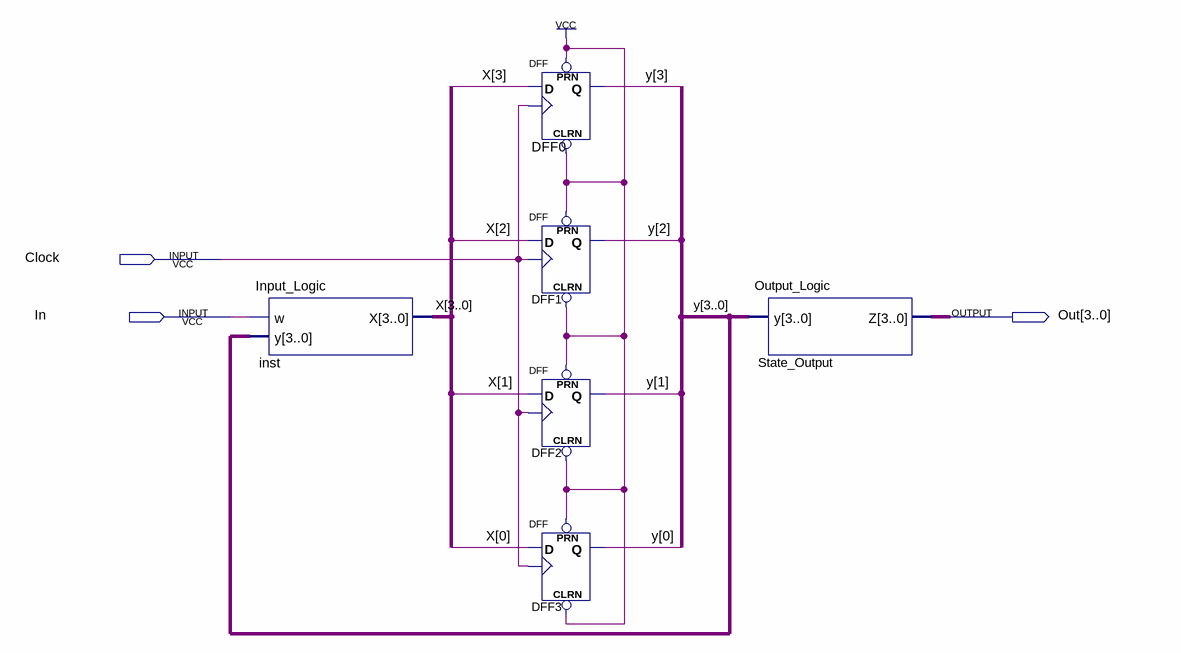
[diagram p0: schematic sheet]
// Quartus schematic TLC_Mk1.bdf as structural Verilog: 6 symbols, 3 pins
module TLC_Mk1 (
  input  Clock,
  input  In,
  output [3:0] Out
);

  wire [3:0] X, y;

  Input_Logic inst (.w(In), .y(y), .X(X));
  DFF DFF0 (.CLRN(1'b1), .CLK(Clock), .D(X[3]), .PRN(1'b1), .Q(y[3]));
  DFF DFF1 (.CLRN(1'b1), .CLK(Clock), .D(X[2]), .PRN(1'b1), .Q(y[2]));
  DFF DFF2 (.CLRN(1'b1), .CLK(Clock), .D(X[1]), .PRN(1'b1), .Q(y[1]));
  DFF DFF3 (.CLRN(1'b1), .CLK(Clock), .D(X[0]), .PRN(1'b1), .Q(y[0]));
  Output_Logic State_Output (.y(y), .Z(Out));
endmodule
